# Altium schematic sheet 10-Microcontroller-1.SchDoc
size A; SheetNumber: 10; SheetTotal: 16
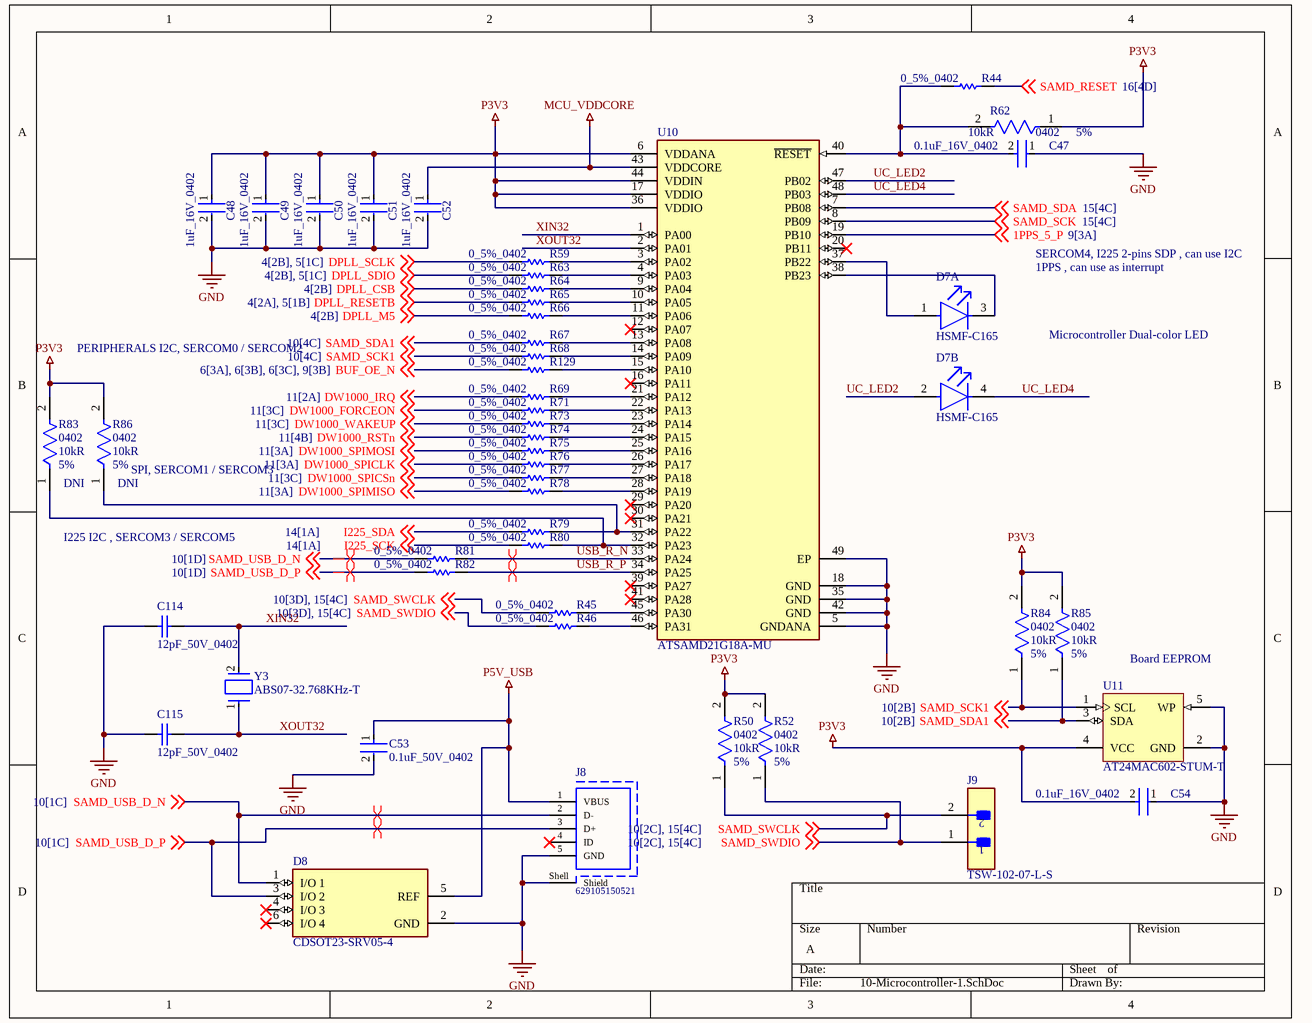
[diagram p0: 10-Microcontroller-1.SchDoc]

## Parts
C47  0.1uF_16V_0402  [FP-GRM15-MFG]
C48  1uF_16V_0402  [FP-0402-L_1_0_0_05-W_0_5-IPC_A]
C49  1uF_16V_0402  [FP-0402-L_1_0_0_05-W_0_5-IPC_A]
C50  1uF_16V_0402  [FP-0402-L_1_0_0_05-W_0_5-IPC_A]
C51  1uF_16V_0402  [FP-0402-L_1_0_0_05-W_0_5-IPC_A]
C52  1uF_16V_0402  [FP-0402-L_1_0_0_05-W_0_5-IPC_A]
C53  0.1uF_50V_0402  [FP-C1005-050-0_05-IPC_C]
C54  0.1uF_16V_0402  [FP-GRM15-MFG]
C114  12pF_50V_0402  [CAPC1005X55X25LL05T05]
C115  12pF_50V_0402  [CAPC1005X55X25LL05T05]
D7  HSMF-C165  [FP-HSMF-C165-MFG]  (parts A,B of 2)
D8  CDSOT23-SRV05-4  [FP-CDSOT23-SRV05-4-MFG]
J8  629105150521  [629105150521]
J9  TSW-102-07-L-S  [FP-TSW-102-07-L-S-MFG]
R44  0_5%_0402  [RESC1005X40X25LL10T10]
R45  0_5%_0402  [RESC1005X40X25LL10T10]
R46  0_5%_0402  [RESC1005X40X25LL10T10]
R50  Case/Package: 0402  Resistance: 10kR  Tolerance: 5%  [FP-CRCW0402-e3-IPC_B]  (hidden comment: CRCW040210K0JNED)
R52  Case/Package: 0402  Resistance: 10kR  Tolerance: 5%  [FP-CRCW0402-e3-IPC_B]  (hidden comment: CRCW040210K0JNED)
R59  0_5%_0402  [RESC1005X40X25LL10T10]
R62  Case/Package: 0402  Resistance: 10kR  Tolerance: 5%  [FP-CRCW0402-e3-IPC_B]  (hidden comment: CRCW040210K0JNED)
R63  0_5%_0402  [RESC1005X40X25LL10T10]
R64  0_5%_0402  [RESC1005X40X25LL10T10]
R65  0_5%_0402  [RESC1005X40X25LL10T10]
R66  0_5%_0402  [RESC1005X40X25LL10T10]
R67  0_5%_0402  [RESC1005X40X25LL10T10]
R68  0_5%_0402  [RESC1005X40X25LL10T10]
R69  0_5%_0402  [RESC1005X40X25LL10T10]
R71  0_5%_0402  [RESC1005X40X25LL10T10]
R73  0_5%_0402  [RESC1005X40X25LL10T10]
R74  0_5%_0402  [RESC1005X40X25LL10T10]
R75  0_5%_0402  [RESC1005X40X25LL10T10]
R76  0_5%_0402  [RESC1005X40X25LL10T10]
R77  0_5%_0402  [RESC1005X40X25LL10T10]
R78  0_5%_0402  [RESC1005X40X25LL10T10]
R79  0_5%_0402  [RESC1005X40X25LL10T10]
R80  0_5%_0402  [RESC1005X40X25LL10T10]
R81  0_5%_0402  [RESC1005X40X25LL10T10]
R82  0_5%_0402  [RESC1005X40X25LL10T10]
R83  Case/Package: 0402  Resistance: 10kR  Tolerance: 5%  [FP-CRCW0402-e3-IPC_B]  (hidden comment: CRCW040210K0JNED)  (no BOM)
R84  Case/Package: 0402  Resistance: 10kR  Tolerance: 5%  [FP-CRCW0402-e3-IPC_B]  (hidden comment: CRCW040210K0JNED)
R85  Case/Package: 0402  Resistance: 10kR  Tolerance: 5%  [FP-CRCW0402-e3-IPC_B]  (hidden comment: CRCW040210K0JNED)
R86  Case/Package: 0402  Resistance: 10kR  Tolerance: 5%  [FP-CRCW0402-e3-IPC_B]  (hidden comment: CRCW040210K0JNED)  (no BOM)
R129  0_5%_0402  [RESC1005X40X25LL10T10]
U10  ATSAMD21G18A-MU  [FP-C04-21493-MFG]
U11  AT24MAC602-STUM-T  [ATML-5TS1_M]
Y3  ABS07-32.768KHz-T  [FP-ABS07-MFG]

## Nets
GND: C47.1 C48.2 C49.2 C50.2 C51.2 C52.2 C53.2 C54.1 C114.2 C115.2 D8.2(GND) J8.5(GND) J8.Shell(Shield) U10.5(GNDANA) U10.18(GND) U10.35(GND) U10.42(GND) U10.49(EP) U11.2(GND) U11.5(WP)
MCU_VDDCORE: C52.1 U10.43(VDDCORE)
P3V3: C48.1 C49.1 C50.1 C51.1 C54.2 R50.2 R52.2 R62.1 R83.2 R84.2 R85.2 R86.2 U10.6(VDDANA) U10.17(VDDIO) U10.36(VDDIO) U10.44(VDDIN) U11.4(VCC)
P5V_USB: C53.1 D8.5(REF) J8.1(VBUS)
1PPS_5_P: U10.19(PB10) ; off-sheet 1PPS_5_P
BUF_OE_N: R129.1 ; off-sheet BUF_OE_N
DPLL_CSB: R64.1 ; off-sheet DPLL_CSB
DPLL_M5: R66.1 ; off-sheet DPLL_M5
DPLL_RESETB: R65.1 ; off-sheet DPLL_RESETB
DPLL_SCLK: R59.1 ; off-sheet DPLL_SCLK
DPLL_SDIO: R63.1 ; off-sheet DPLL_SDIO
DW1000_FORCEON: R71.1 ; off-sheet DW1000_FORCEON
DW1000_IRQ: R69.1 ; off-sheet DW1000_IRQ
DW1000_RSTn: R74.1 ; off-sheet DW1000_RSTn
DW1000_SPICLK: R76.1 ; off-sheet DW1000_SPICLK
DW1000_SPICSn: R77.1 ; off-sheet DW1000_SPICSn
DW1000_SPIMISO: R78.1 ; off-sheet DW1000_SPIMISO
DW1000_SPIMOSI: R75.1 ; off-sheet DW1000_SPIMOSI
DW1000_WAKEUP: R73.1 ; off-sheet DW1000_WAKEUP
I225_SCK: R80.1 ; off-sheet I225_SCK
I225_SDA: R79.1 ; off-sheet I225_SDA
SAMD_RESET: R44.2 ; off-sheet SAMD_RESET
SAMD_SCK: U10.8(PB09) ; off-sheet SAMD_SCK
SAMD_SCK1: R68.1 R84.1 U11.1(SCL) ; off-sheet SAMD_SCK1
SAMD_SDA: U10.7(PB08) ; off-sheet SAMD_SDA
SAMD_SDA1: R67.1 R85.1 U11.3(SDA) ; off-sheet SAMD_SDA1
SAMD_SWCLK: J9.2 R45.1 R50.1 ; off-sheet SAMD_SWCLK
SAMD_SWDIO: J9.1 R46.1 R52.1 ; off-sheet SAMD_SWDIO
SAMD_USB_D_N: D8.1(I/O_1) J8.2(D-) R81.1 ; off-sheet SAMD_USB_D_N
SAMD_USB_D_P: D8.3(I/O_2) J8.3(D+) R82.1 ; off-sheet SAMD_USB_D_P
UC_LED2: D7.2(RED_A) U10.47(PB02)
UC_LED4: D7.4(RED_C) U10.48(PB03)
USB_R_N: R81.2 U10.33(PA24)
USB_R_P: R82.2 U10.34(PA25)
XIN32: C114.1 U10.1(PA00) Y3.2
XOUT32: C115.1 U10.2(PA01) Y3.1
NetC47_2: C47.2 R44.1 R62.2 U10.40(~{RESET})
NetD7_1: D7.1(GREEN_A) U10.37(PB22)
NetD7_3: D7.3(GREEN_C) U10.38(PB23)
NetR45_2: R45.2 U10.45(PA30)
NetR46_2: R46.2 U10.46(PA31)
NetR59_2: R59.2 U10.3(PA02)
NetR63_2: R63.2 U10.4(PA03)
NetR64_2: R64.2 U10.9(PA04)
NetR65_2: R65.2 U10.10(PA05)
NetR66_2: R66.2 U10.11(PA06)
NetR67_2: R67.2 U10.13(PA08)
NetR68_2: R68.2 U10.14(PA09)
NetR69_2: R69.2 U10.21(PA12)
NetR71_2: R71.2 U10.22(PA13)
NetR73_2: R73.2 U10.23(PA14)
NetR74_2: R74.2 U10.24(PA15)
NetR75_2: R75.2 U10.25(PA16)
NetR76_2: R76.2 U10.26(PA17)
NetR77_2: R77.2 U10.27(PA18)
NetR78_2: R78.2 U10.28(PA19)
NetR79_2: R79.2 R86.1 U10.31(PA22)
NetR80_2: R80.2 R83.1 U10.32(PA23)
NetR129_2: R129.2 U10.15(PA10)

Not connected (* = marked no-connect by the designer): D8 4(I/O_3)* 6(I/O_4)*; J8 4(ID)*; U10 12(PA07)* 16(PA11)* 20(PB11)* 29(PA20)* 30(PA21)* 39(PA27)* 41(PA28)*

## Layout directives
differential pair; differential pair class 100ohm: SAMD_USB_D_N, SAMD_USB_D_P
differential pair; differential pair class 90ohm: SAMD_USB_D_N, SAMD_USB_D_P, USB_R_N, USB_R_P

## Notes on the sheet
- SERCOM4, I225 2-pins SDP , can use I2C
- 1PPS , can use as interrupt
- PERIPHERALS I2C, SERCOM0 / SERCOM2
- Microcontroller Dual-color LED
- (near R86) SPI, SERCOM1 / SERCOM3
- I225 I2C , SERCOM3 / SERCOM5
- (near U11) Board EEPROM

## Library data of the parts
C47 C54 = CMP-2100-03641-2: CAP CER 0.1UF 16V X7R 0402; Manufacturer Part Number: GRM155R71C104KA88D; Manufacturer: Murata; Standoff Height: 0mm; Tolerance: 10%; Voltage Rating: 16Vdc; Material: Ceramic; Capacitance: 0.10μF; Value: 0.10μF; RoHS: TRUE; Temperature Characteristic: X7R; Octopart: https://octopart.com/grm155r71c104ka88d-murata-196880; Digikey Description: CAP CER 0.1UF 16V X7R 0402; Device Class L3: Ceramic Capacitors; Height: 0.55mm; ComponentLink2Description: Datasheet; Temperature Range Low: -55°C; Ipc Land Pattern Name: CAPC10050X219; ComponentLink2URL: https://search.murata.co.jp/Ceramy/image/img/A01X/G101/ENG/GRM155R71H471KA01-01A.pdf; Device Class L1: Passive Components; Lead Free: yes; Category: Cap; Package: GRM15; Temperature: -55°C to +125°C; Device Class L2: Capacitors; Temperature Range High: +125°C; Mouser Description: 0402 0.1 uF 16V ±10 % Tolerance X7R SMT Multilayer Ceramic Capacitor
C48-C52 = CMP-14477-000104-2: None; Tolerance: 10%; Voltage Rating: 16V; Dielectric: X5R; Capacitance: 1uF; Packaging: Tape and Reel; Depth: 0.5mm; Mount: Surface Mount; Thickness: 0.022inch; Package Quantity: 1; Min Operating Temperature: -55°C; Series: M; Voltage Rating (DC): 16V; Termination: SMD/SMT; Case/Package: 0402; Number of Pins: 2; Case Code (Imperial): 0402; Length: 1mm; Halogen Free: Halogen Free; Case Code (Metric): 1005; Width: 0.02inch; RoHS Compliant: Yes; Radiation Hardening: No; Max Operating Temperature: 85°C; Height: 0.5mm; Construction: Flat
C53 = CMP-2000-05393-2: Multilayer Ceramic Capacitors 100nF ±10% 50V X7R SMD 0402; Voltage: 50V; Dielectric Material: Ceramic; Min Operating Temperature: -55°C; Depth: 0.5mm; Radiation Hardening: No; RoHS Compliant: Yes; Voltage Rating (DC): 50V; Lead Free: Lead Free; Resistor Type: Ceramic; Height: 0.5mm; Dielectric: X7R; Thickness: 0.022inch; Case/Package: 0402; Case Code (Metric): 1005; Termination: SMD/SMT; Capacitance: 100nF; Packaging: Tape and Reel; Max Operating Temperature: 125°C; Mount: Surface Mount; Package Quantity: 1; Width: 0.02inch; Weight: 2.3E-05oz; Voltage Rating: 50V; Tolerance: 10%; Construction: Flat; Case Code (Imperial): 0402; Length: 1mm; REACH SVHC: No SVHC; Series: C
C114 C115 = CMP-2000-06069-1: Chip Capacitor, 12 pF, +/- 5%, 50 V, -55 to 125 degC, 0402 (1005 Metric), RoHS, Tape and Reel; Manufacturer: Yageo; Capacitance: 12pF; Voltage - Rated: 50V; Other Names: 311-1016-6311-1266-6311-1266-6-ND; Catalog Drawings: CC_0402; Featured Product: CommodityMultilayerCeramicCapacitors–CCSeries; Product Training Modules: MultilayerCeramicCapacitors; Online Catalog: CCSeries; Temperature Coefficient: C0G,NP0; Mounting Technology: SurfaceMount; Package Reference: 0402; Lead Style: -; Datasheet URL: http://www.yageo.com/NewPortal/yageodocoutput?fileName=/pdf/MLCC/UPY-GP_NP0_16V-to-50V_14.pdf; Height - Seated (Max): -; Mounting Type: SurfaceMount,MLCC; Series: CC; Standard Package: 1; Manufacturer URL: http://www.yageo.com/; Package / Case: 0402(1005Metric); Features: -; Applications: GeneralPurpose; Family: CeramicCapacitors; Size / Dimension: 0.039"Lx0.020"W(1.00mmx0.50mm); Ratings: -; Package Description: 2-Pin Surface Mount Device, Body 1 x 0.5 mm; Datasheet Version: Rev. 14, 07/2016; Lead Spacing: -; Packaging: Digi-Reel®; Category: Capacitors; Tolerance: ±5%; Thickness (Max): 0.022"(0.55mm); Operating Temperature: -55°C~125°C
D7 = CMP-2000-06424-2: LED GREEN/RED DIFFUSED 0603 SMD; Reverse Voltage: 5V; Dominant Wavelength: 621nm; Number of Elements: 2; Shape: Rectangular; Luminous Intensity: 10mcd; Forward Current: 20mA; Lens Color: White; Illumination Color: Green; Power Dissipation: 52mW; Wavelength: 572nm; Viewing Angle: 120°; Forward Voltage: 2.2V; Max Operating Temperature: 85°C; Lens Transparency: Diffused; Width: 0.8mm; Case/Package: 0603; Packaging: Tape and Reel; Case Code (Metric): 1608; Depth: 0.8mm; REACH SVHC: No SVHC; Number of LEDs: 2; Radiation Hardening: No; Lens Style: Rectangular; Color: Green; Case Code (Imperial): 0603; Min Operating Temperature: -40°C; Power Rating: 52mW; Number of Pins: 4; Number of Terminals: 4; Package Quantity: 1; Mount: Surface Mount; Height: 0.5mm; Length: 1.6mm; Lead Free: Lead Free; Test Current: 20mA
D8 = CMP-07401-000007-1: TVS DIODE 5V 15V SOT23-6; Manufacturer: Bourns Inc.; Standoff Height: 0.2mm; Direction: Bidirectional; Peak Pulse Power: 500W; Max Junction Temp: +150°C; Number Of Channels: 4; Breakdown Voltage: 6V; Peak Pulse Current: 30A; Temperature Range High: +150°C; RoHS: TRUE; Category: Diode; Clamping Voltage: 15V; Reverse Standoff Voltage: 5V; Manufacturer Part Number: CDSOT23-SRV05-4; Octopart: https://octopart.com/cdsot23-srv05-4-bourns-1679449; Automotive: No; ComponentLink2URL: https://www.bourns.com/docs/Product-Datasheets/CDSOT23-SRV05-4.pdf; Device Class L1: Circuit Protection; Temperature: -55°C to +150°C; Device Class L2: TVS Diodes; Temperature Range Low: -55°C; Lead Free: Yes; Device Class L3: unset; Height: 1.45mm; Package: CDSOT23-SRV05-4; Ipc Land Pattern Name: SOT95P280X118-6; Mouser Description: CDSOT23-SRV05-4, Quad Uni-Directional TVS Diode, 500W, 6-Pin SOT-23; ComponentLink2Description: Datasheet; Digikey Description: TVS DIODE 5V 15V SOT23-6
J8 = CMP-1502-03252-1: Micro USB 2.0 Type B Receptacle WR-COM, Horizontal, SMT, with Pegs, High Current at Pin 1 & Pin 5; Manufacturer: Wurth Elektronik; Contact Resistance: 30mOhm; Rated Current: 3A; Working Voltage: 30VAC; Package Reference: 629105150521; Mounting Technology: SMT; Connector Type: MicroUSB2.0TypeB; Operating Temperature: -40to85degC; Orientation: Horizontal; Manufacturer URL: http://www.we-online.de; Datasheet URL: https://katalog.we-online.de/em/datasheet/629105150521.pdf; Part Number: 629105150521; Packaging: TapeandReel; Gender: Receptacle; Publisher: WurthElektronik
J9 = CMP-02766-001428-1: CONN HEADER VERT 2POS 2.54MM; Voltage Rating: 550V; Current Rating: 7.6A; Gender: Male; Number of Contacts: 2; Connector Type: Male Pin; Radiation Hardening: No; Orientation: Straight; Contact Plating: Gold; Max Operating Temperature: 125°C; Mount: Through Hole; Package Quantity: 1; Number of Rows: 1; Housing Material: Polyester; RoHS Compliant: Yes; Length: 5.08mm; Max Voltage Rating (AC): 550V; Pitch: 2.54mm; Packaging: Bulk; Depth: 2.54mm; Termination: Solder; Min Operating Temperature: -55°C; Housing Color: Black; Lead Free: Lead Free; Color: Black; Number of Positions: 2; Width: 2.54mm; Max Current Rating: 7.6A; REACH SVHC: No SVHC; Contact Material: Bronze; Contact Mating Length: 0.23inch; Series: TSW; Contact Type: Male Pin
R44-R46 R59 R63-R69 R71 R73-R82 R129 = CMP-2002-04569-1: Manufacturer: KOA Speer; Part Number: RK73Z1ETTP
R50 R52 R62 R83-R86 = CMP-2002-08136-3: RES Thick Film, 10kΩ, 5%, 0.063W, 200ppm/°C, 0402; Voltage Rating: 50V; Power Rating: 63mW; Military Standard: Not; Packaging: Tape and Reel; Case Code (Imperial): 0402; Min Operating Temperature: -55°C; Case Code (Metric): 1005; Temperature Coefficient: 200ppm/°C; Termination: SMD/SMT; Composition: Thick Film; Depth: 0.5mm; Number of Terminations: 2; Contact Plating: Tin; Height: 0.016inch; Width: 0.5mm; Max Operating Temperature: 155°C; Features: Automotive AEC-Q200; Length: 1mm; Radiation Hardening: No; Max Power Dissipation: 63mW; Mount: Surface Mount; Package Quantity: 1; Weight: 2.3E-05oz
  R83 R86: DNI: DNI
U10 = CMP-06276-000052-1: IC MCU 32BIT 256KB FLASH 48QFN; Interface: I2C; Oscillator Type: Internal; Core Architecture: ARM; Peripherals: Brown-out Detect/Reset; Number of I/Os: 38; Frequency: 48MHz; Max Operating Temperature: 85°C; Memory Size: 256KB; Memory Type: FLASH; Case/Package: QFN; Packaging: Tray; Min Operating Temperature: -40°C
U11 = CMP-2100-03583-1: 2-Kbit (256 x 8), 2-wire Serial EEPROM with a Factory-Programmed EUI-64(TM)Address Plus an Embedded Unique 128-bit Serial Number, 1.7 to 5.5 V, -40 to 85 degC, 5-Pin SOT23 (5TS1), Tape and Reel; Manufacturer: Atmel; Min Supply Voltage: 1.7V; Nominal Supply Current: 3mA; Max Frequency: 1MHz; Max Supply Voltage: 5.5V; Number of Pins: 5; RoHSCompliant: true; Mount: SurfaceMount; Datasheet URL: http://www.atmel.com/Images/Atmel-8807-SEEPROM-AT24MAC402-602-Datasheet.pdf; Frequency: 1MHz; Min Operating Temperature: -40degC; Package Reference: 5TS1; Radiation Hardening: No; Package Description: 5-Pin Plastic Thin Shrink Small Outline Package, Body 2.9 x 1.6 mm, Pitch 0.95 mm; Package Quantity: 5000; Packaging: TapeandReel; Max Operating Temperature: 85degC; Case/Package: SOT-23; Manufacturer URL: http://www.atmel.com/; Datasheet Version: Rev. 8808E, 01/2015
Y3 = CMP-0447-00001-3: CRYSTAL 32.7680KHZ 12.5PF SMD; Frequency Tolerance: 20ppm; Series Resistance: 70kR; Operating Frequency: 32.768 kHz; Number of Pins: 2; Package Quantity: 3000; Tolerance: 20ppm; Max Operating Temperature: 85°C; Width: 0.061inch; Frequency: 32.768kHz; Termination: SMD/SMT; Min Operating Temperature: -40°C; Radiation Hardening: No; Series: ABS07; Length: 3.2mm; Case/Package: CSMD; ESR (Equivalent Series Resistance): 70kR; RoHS Compliant: Yes; Load Capacitance: 12.5pF; Depth: 1.5mm; REACH SVHC: No SVHC; Height: 0.035inch; Packaging: Tape and Reel; Lead Free: Lead Free